# Altium schematic sheet Relay_PWR_Sheet.SchDoc
size 420 x 297 mm; SheetNumber: 8; SheetTotal: 9
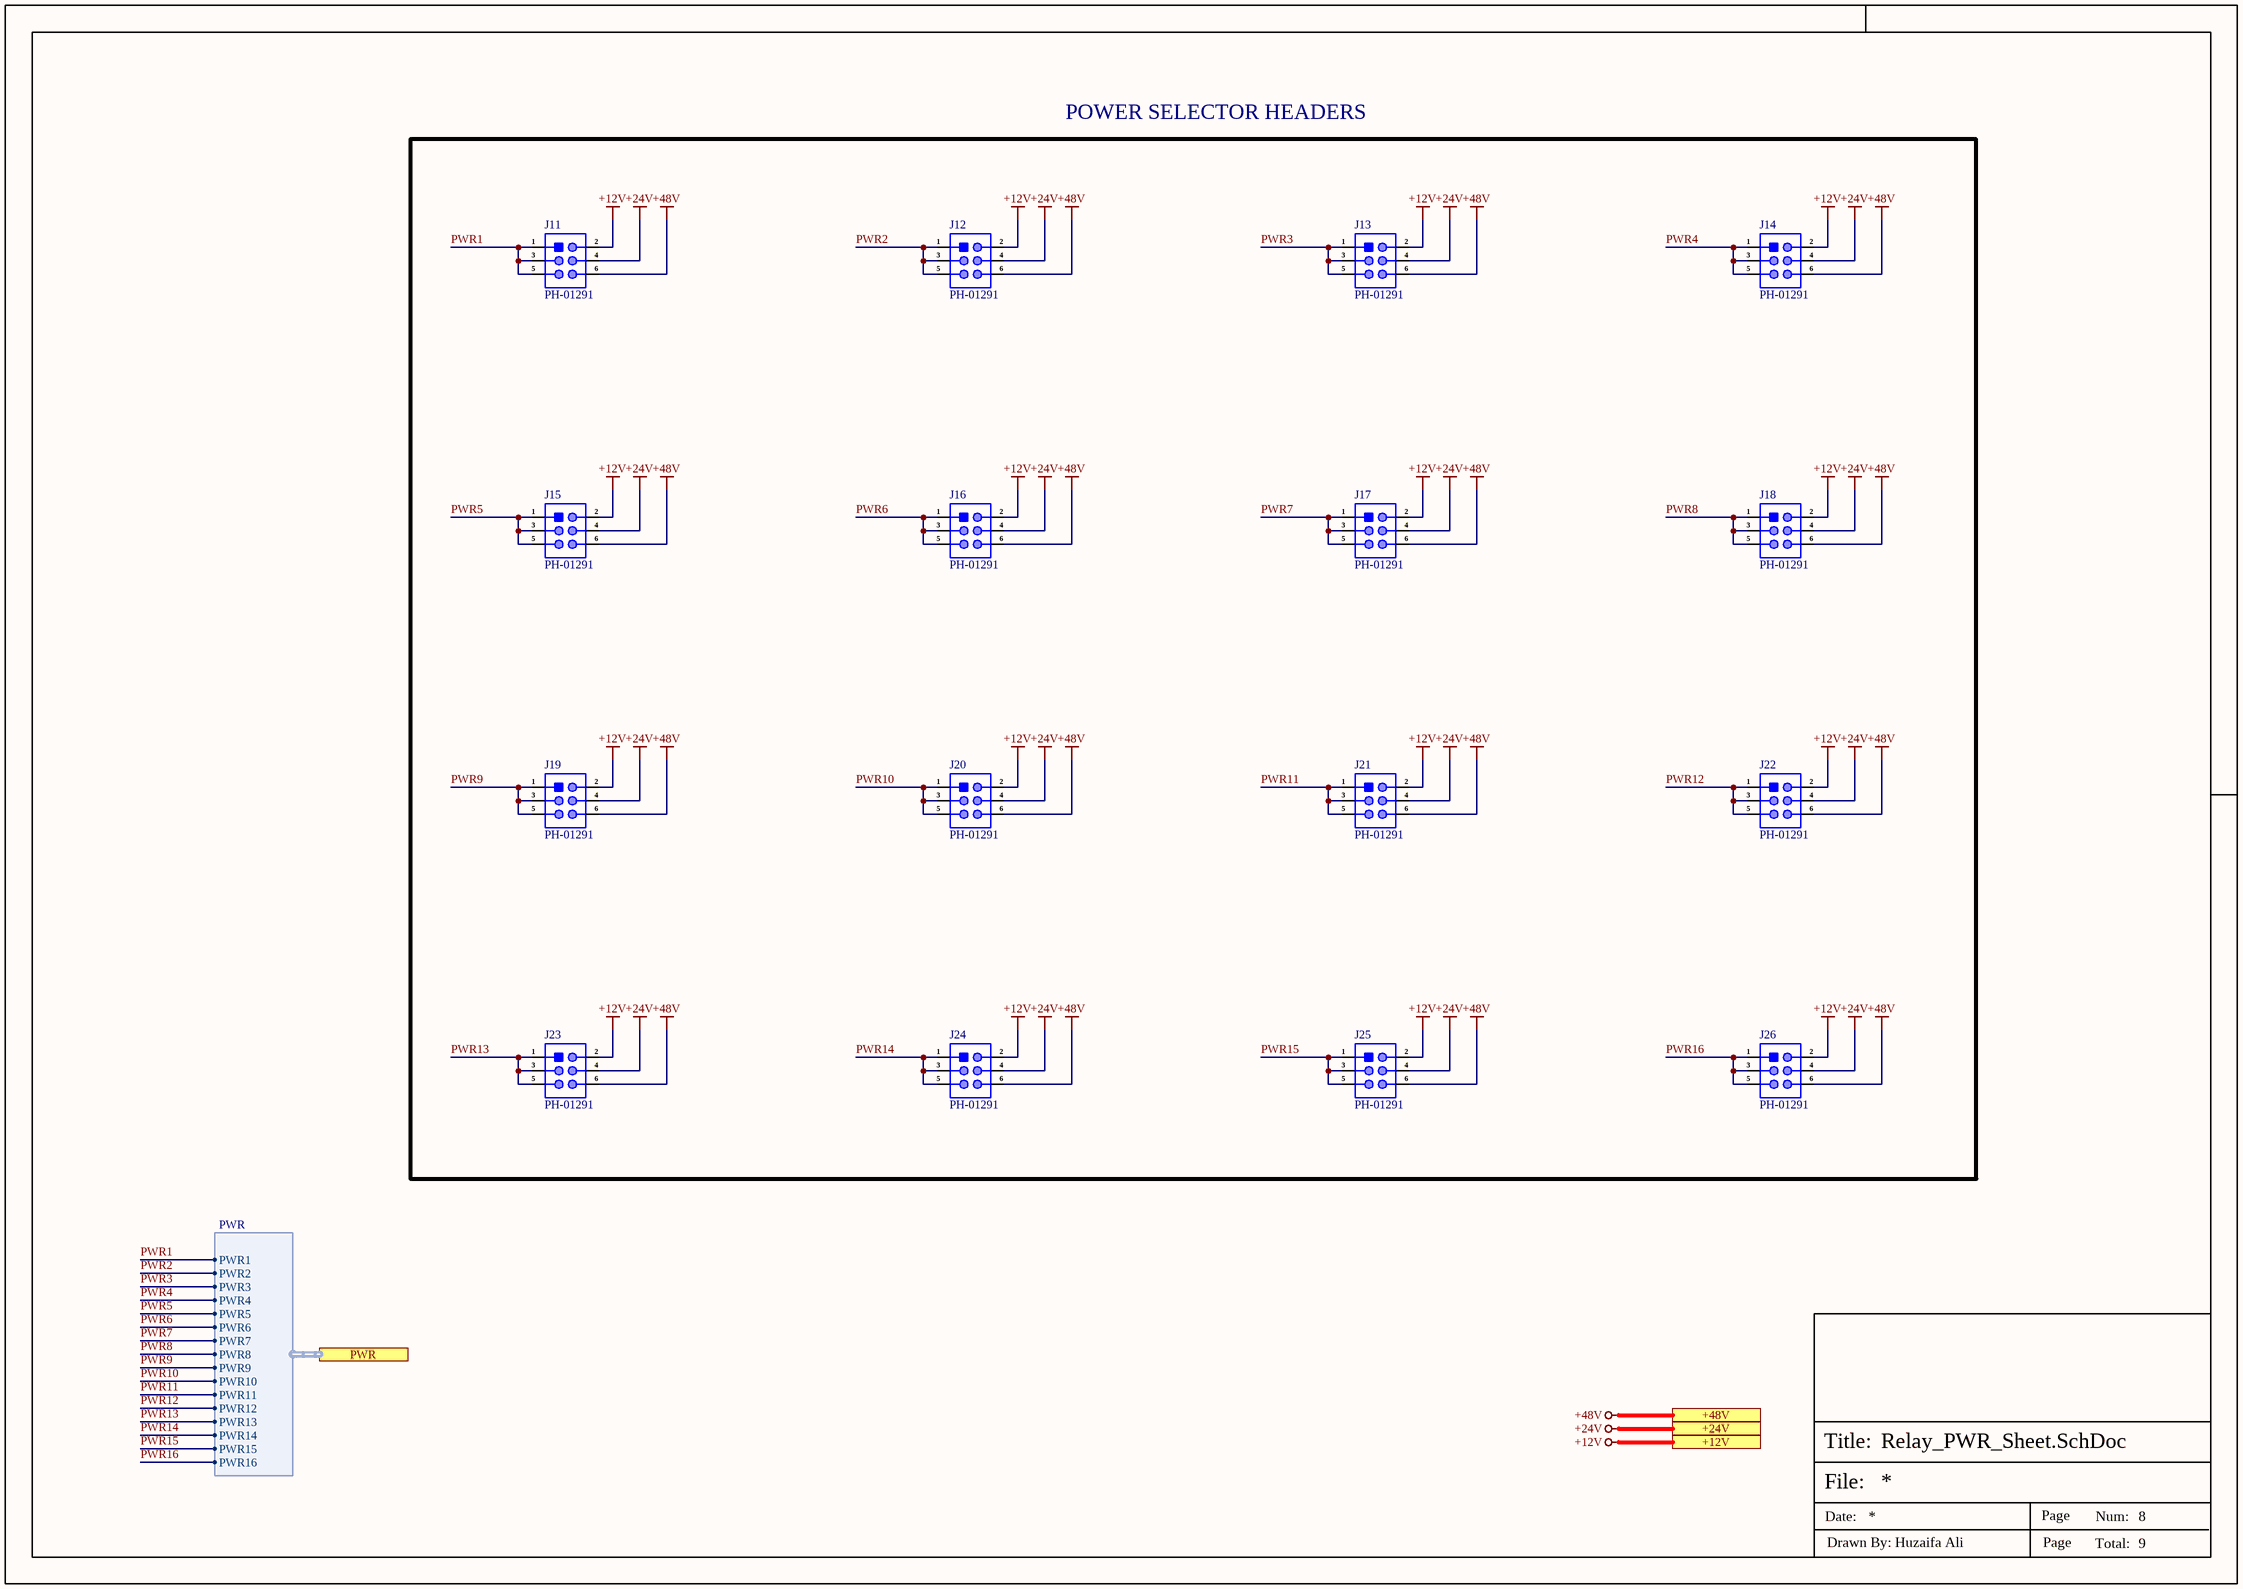
[diagram p0: Relay_PWR_Sheet.SchDoc]

## Parts
J11  PH-01291  [PH-01291]
J12  PH-01291  [PH-01291]
J13  PH-01291  [PH-01291]
J14  PH-01291  [PH-01291]
J15  PH-01291  [PH-01291]
J16  PH-01291  [PH-01291]
J17  PH-01291  [PH-01291]
J18  PH-01291  [PH-01291]
J19  PH-01291  [PH-01291]
J20  PH-01291  [PH-01291]
J21  PH-01291  [PH-01291]
J22  PH-01291  [PH-01291]
J23  PH-01291  [PH-01291]
J24  PH-01291  [PH-01291]
J25  PH-01291  [PH-01291]
J26  PH-01291  [PH-01291]

## Blocks framed on the sheet
POWER SELECTOR HEADERS: J11-J26

## Ports
+12V (see Power_Sheet[5D]), +24V (see Connector_Sheet[5D], Power_Sheet[5D]), +48V (see Power_Sheet[5D]), PWR (harness PWR, see Relay_Sheet[4D])

## Harnesses
PWR: PWR1, PWR2, PWR3, PWR4, PWR5, PWR6, PWR7, PWR8, PWR9, PWR10, PWR11, PWR12, PWR13, PWR14, PWR15, PWR16

## Nets
+12V: J11.2 J12.2 J13.2 J14.2 J15.2 J16.2 J17.2 J18.2 J19.2 J20.2 J21.2 J22.2 J23.2 J24.2 J25.2 J26.2 ; port +12V
+24V: J11.4 J12.4 J13.4 J14.4 J15.4 J16.4 J17.4 J18.4 J19.4 J20.4 J21.4 J22.4 J23.4 J24.4 J25.4 J26.4 ; port +24V
+48V: J11.6 J12.6 J13.6 J14.6 J15.6 J16.6 J17.6 J18.6 J19.6 J20.6 J21.6 J22.6 J23.6 J24.6 J25.6 J26.6 ; port +48V
PWR1: J11.1 J11.3 J11.5 ; port PWR.PWR1
PWR2: J12.1 J12.3 J12.5 ; port PWR.PWR2
PWR3: J13.1 J13.3 J13.5 ; port PWR.PWR3
PWR4: J14.1 J14.3 J14.5 ; port PWR.PWR4
PWR5: J15.1 J15.3 J15.5 ; port PWR.PWR5
PWR6: J16.1 J16.3 J16.5 ; port PWR.PWR6
PWR7: J17.1 J17.3 J17.5 ; port PWR.PWR7
PWR8: J18.1 J18.3 J18.5 ; port PWR.PWR8
PWR9: J19.1 J19.3 J19.5 ; port PWR.PWR9
PWR10: J20.1 J20.3 J20.5 ; port PWR.PWR10
PWR11: J21.1 J21.3 J21.5 ; port PWR.PWR11
PWR12: J22.1 J22.3 J22.5 ; port PWR.PWR12
PWR13: J23.1 J23.3 J23.5 ; port PWR.PWR13
PWR14: J24.1 J24.3 J24.5 ; port PWR.PWR14
PWR15: J25.1 J25.3 J25.5 ; port PWR.PWR15
PWR16: J26.1 J26.3 J26.5 ; port PWR.PWR16

## Notes on the sheet
- File:
- Title:
- Date:
- Page
- Num:
- Total:
- Drawn By: Huzaifa Ali

## Library data of the parts
J11-J26 = PH-01291: 3A Straight Square Pins 2.5mm 6P 6mm -40℃~+105℃ 3mm 2.54mm 双排 Black 2x3P 2.54mm Plugin,P=2.54mm Pin Headers ROHS; Manufacturer: Liansheng; Item Type: Male Header; Manufacturer Part Number: PH-01291; LCSC Part No: C2685197; ComponentLink1URL: https://www.lcsc.com/product-detail/Pin-Headers_Liansheng-PH-01291_C2685197.html; ComponentLink1Description: LCSC